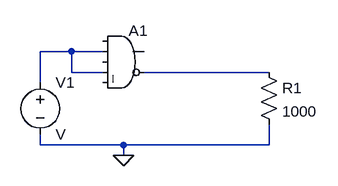
[diagram p0: schematic Draft3.asc]
Draft3.asc, the LTspice schematic file:
Version 4
SHEET 1 880 680
WIRE 32 96 -16 96
WIRE 80 96 32 96
WIRE 32 128 32 96
WIRE 80 128 32 128
WIRE 336 128 144 128
WIRE -16 144 -16 96
WIRE -16 240 -16 224
WIRE 112 240 -16 240
WIRE 336 240 336 208
WIRE 336 240 112 240
WIRE 112 256 112 240
FLAG 112 256 0
SYMBOL Digital\\and 112 48 R0
SYMATTR InstName A1
SYMBOL res 320 112 R0
SYMATTR InstName R1
SYMATTR Value 1000
SYMBOL voltage -16 128 R0
SYMATTR InstName V1

The netlist it stands for:
* Draft3.asc
A1 0 N001 0 N001 0 N002 0 0 AND
R1 N002 0 1000
V1 N001 0 V
.backanno
.end